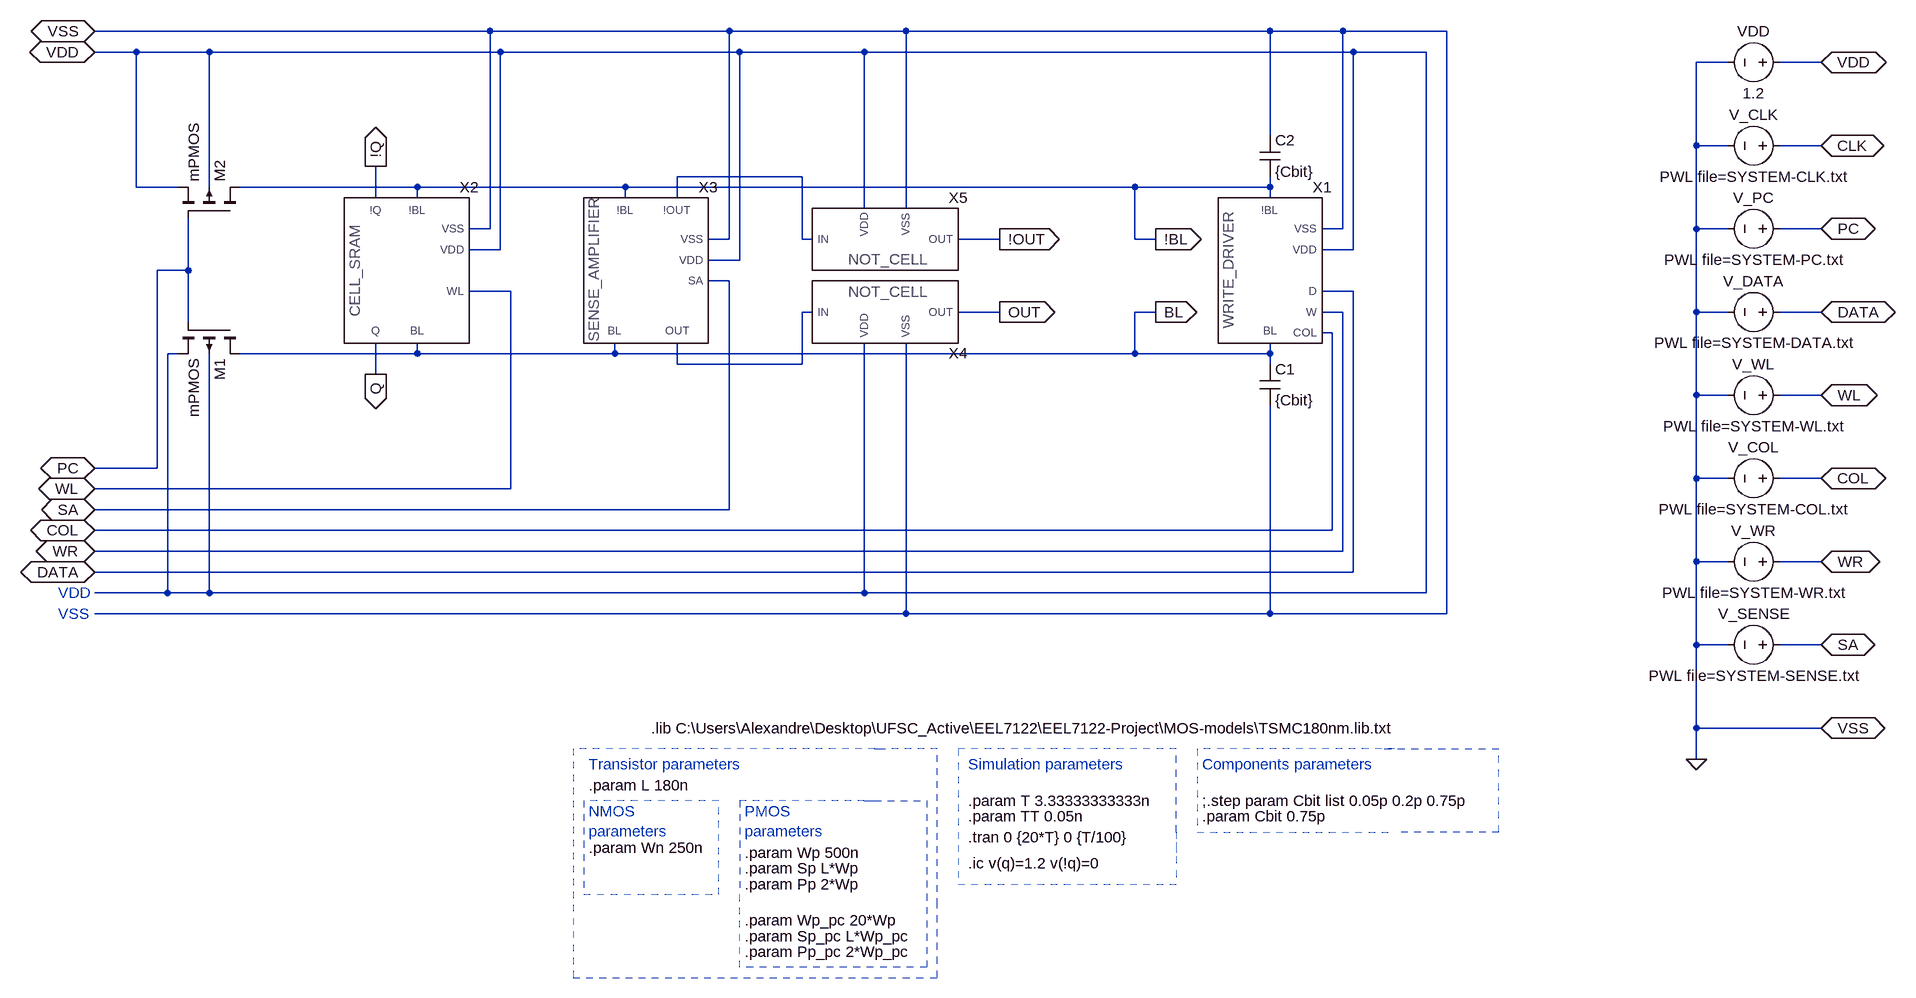
[diagram p0: schematic SYSTEM.asc]
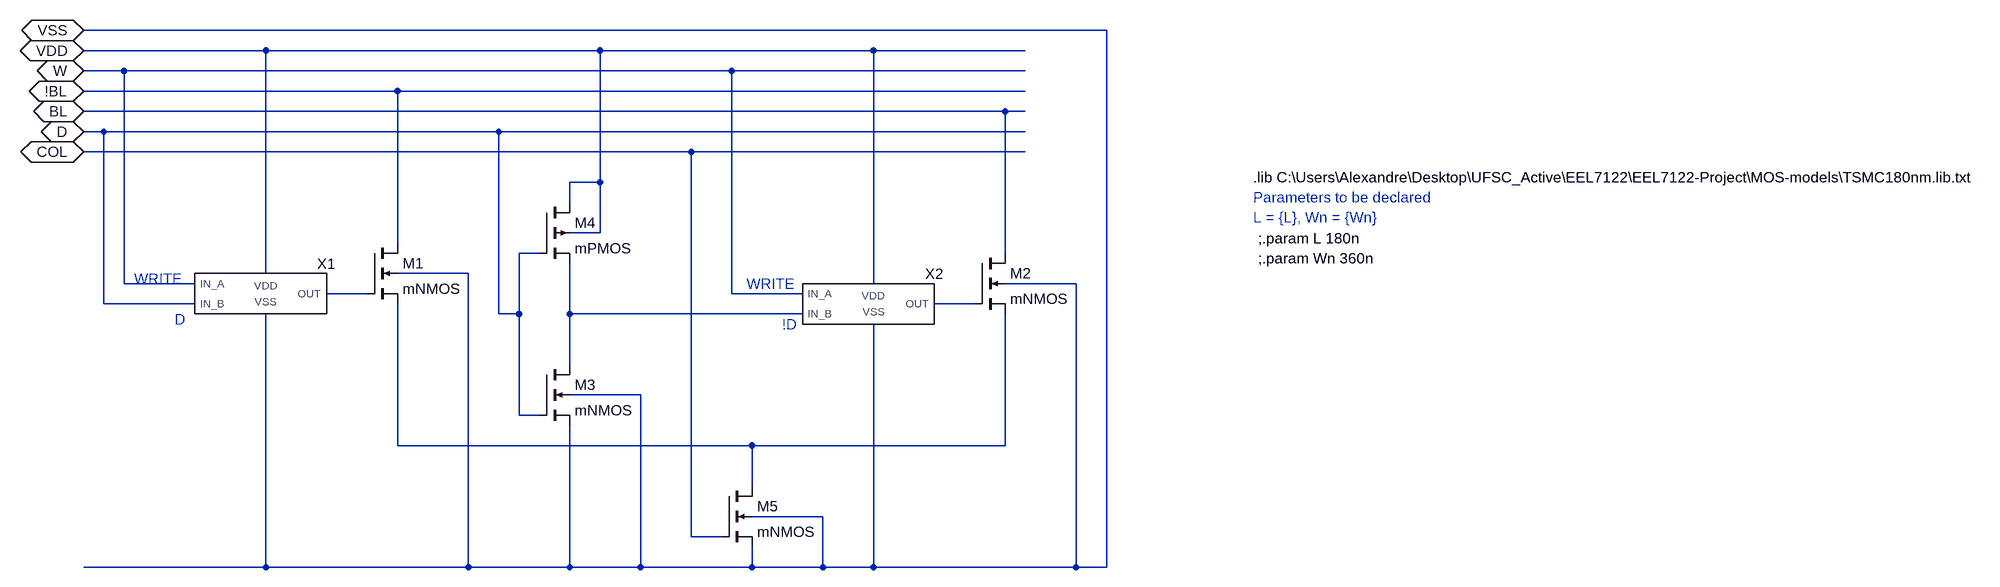
[diagram p1: sub-circuit write_driver.asc]
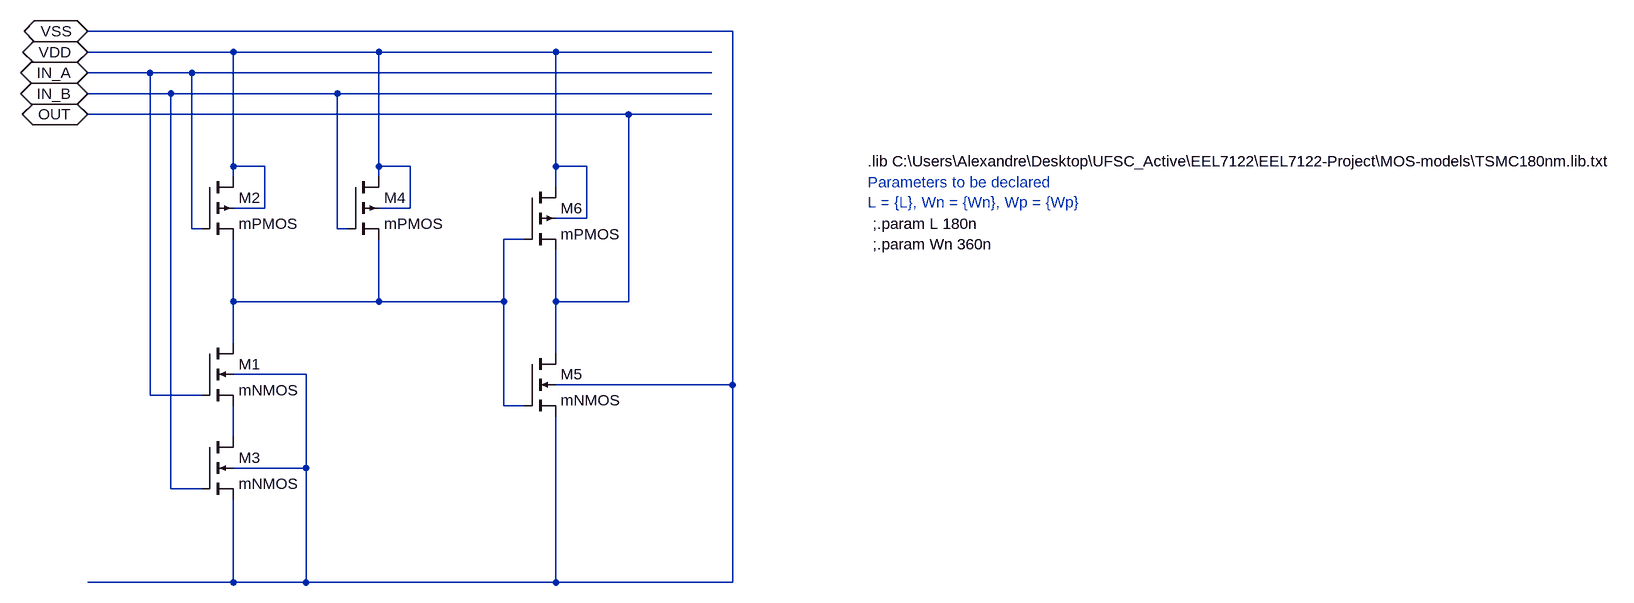
[diagram p2: sub-circuit and_sram.asc]
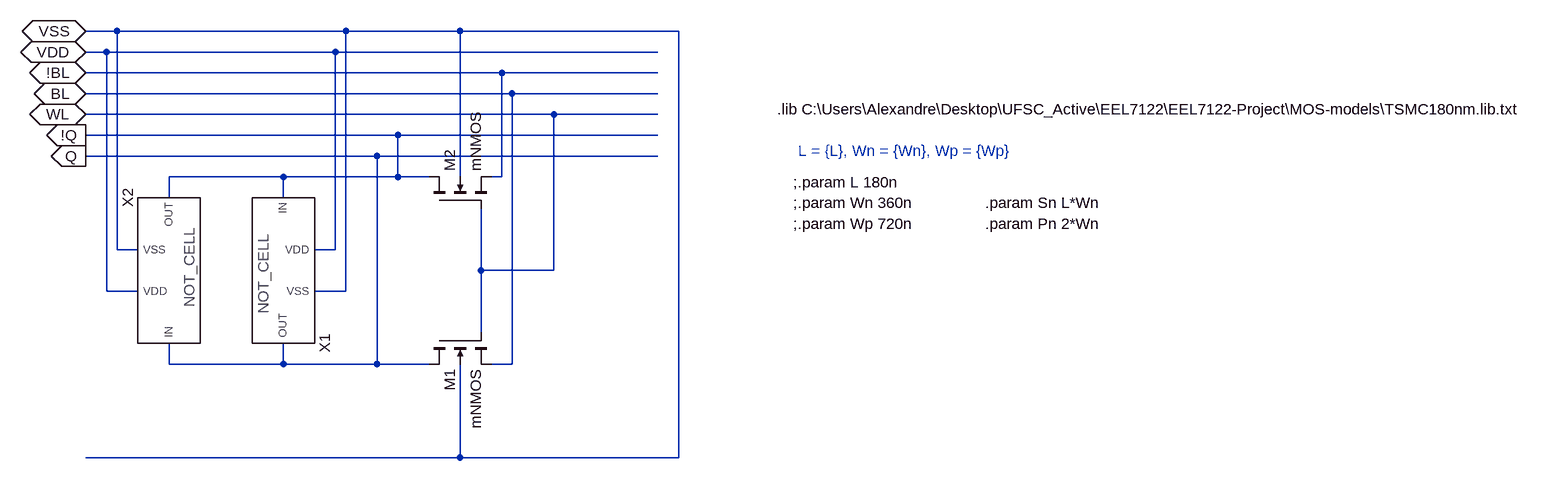
[diagram p3: sub-circuit cell_sram.asc]
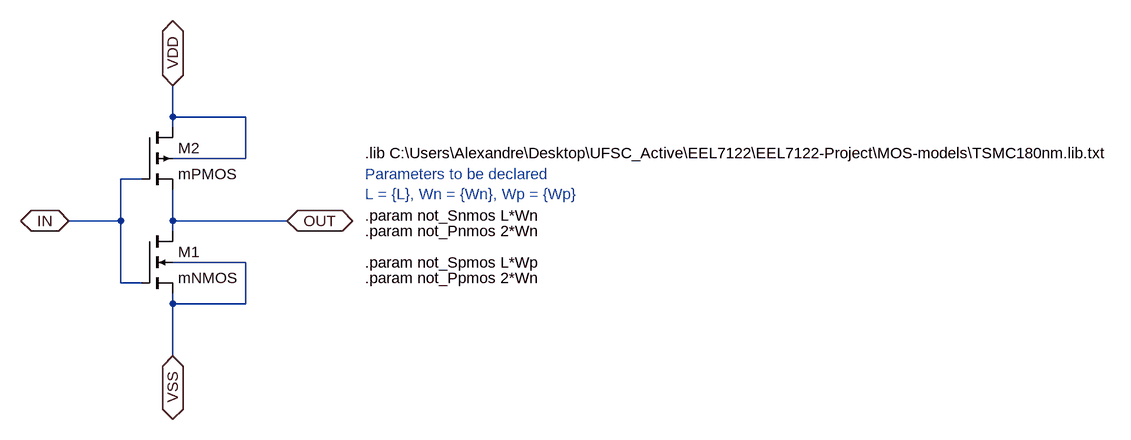
[diagram p4: sub-circuit not_cell.asc]
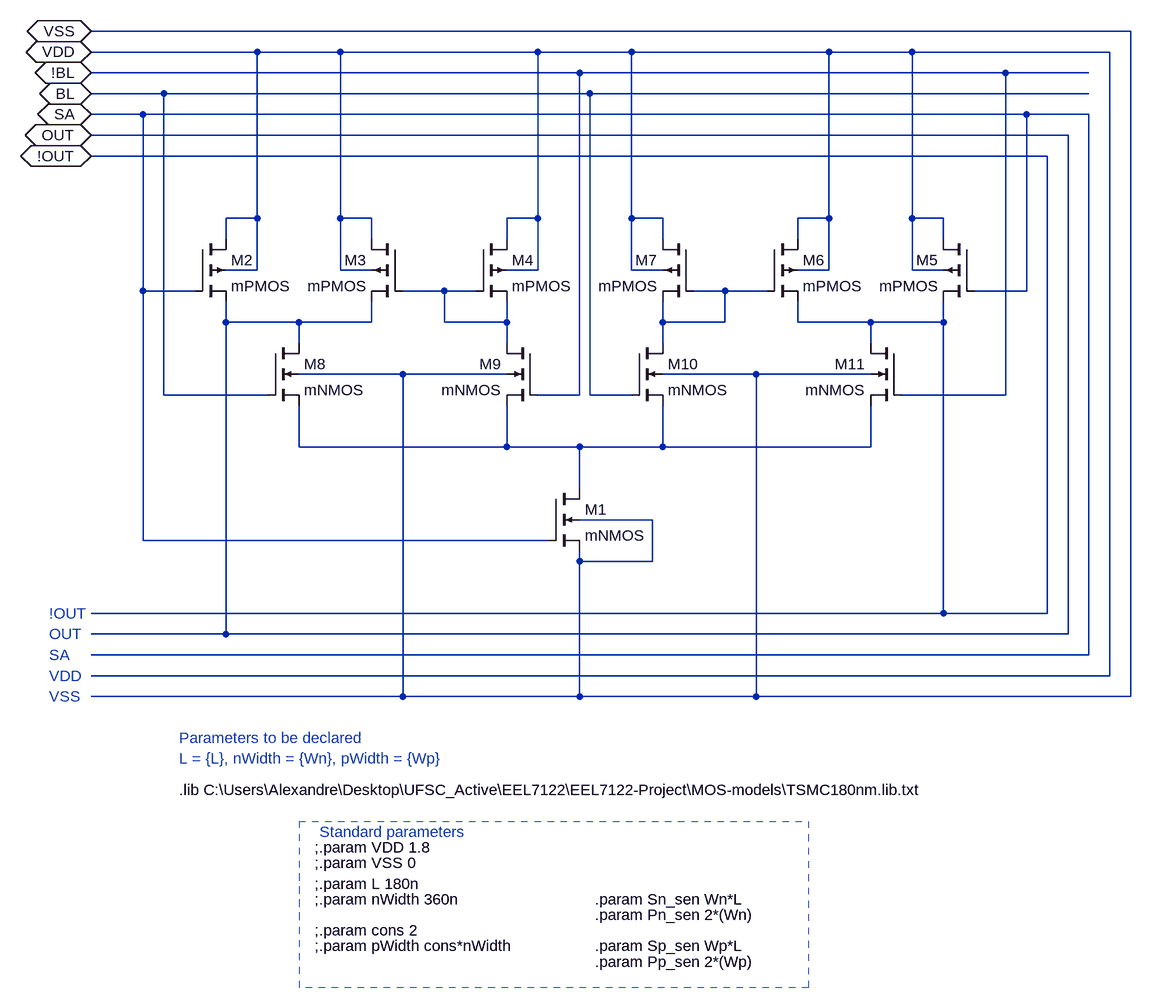
[diagram p5: sub-circuit sen_amp_2.asc]
SYSTEM.asc, the LTspice schematic file:
Version 4
SHEET 1 2612 1236
WIRE -432 -224 -1040 -224
WIRE -64 -224 -432 -224
WIRE 208 -224 -64 -224
WIRE 768 -224 208 -224
WIRE 880 -224 768 -224
WIRE 1040 -224 880 -224
WIRE -976 -192 -1040 -192
WIRE -864 -192 -976 -192
WIRE -416 -192 -864 -192
WIRE -48 -192 -416 -192
WIRE 144 -192 -48 -192
WIRE 896 -192 144 -192
WIRE 1008 -192 896 -192
WIRE 1472 -176 1424 -176
WIRE 1616 -176 1552 -176
WIRE 768 -64 768 -224
WIRE 1424 -48 1424 -176
WIRE 1472 -48 1424 -48
WIRE 1616 -48 1552 -48
WIRE 48 0 -144 0
WIRE -976 16 -976 -192
WIRE -912 16 -976 16
WIRE -864 16 -864 -192
WIRE -544 16 -816 16
WIRE -224 16 -544 16
WIRE 560 16 -224 16
WIRE 768 16 768 0
WIRE 768 16 560 16
WIRE -608 32 -608 -16
WIRE -544 32 -544 16
WIRE -224 32 -224 16
WIRE -144 32 -144 0
WIRE 768 32 768 16
WIRE 144 48 144 -192
WIRE 208 48 208 -224
WIRE -432 80 -432 -224
WIRE -432 80 -464 80
WIRE 880 80 880 -224
WIRE 880 80 848 80
WIRE 1424 80 1424 -48
WIRE 1472 80 1424 80
WIRE 1616 80 1552 80
WIRE -64 96 -64 -224
WIRE -64 96 -96 96
WIRE 48 96 48 0
WIRE 64 96 48 96
WIRE 352 96 288 96
WIRE 560 96 560 16
WIRE 592 96 560 96
WIRE -416 112 -416 -192
WIRE -416 112 -464 112
WIRE 896 112 896 -192
WIRE 896 112 848 112
WIRE -48 128 -48 -192
WIRE -48 128 -96 128
WIRE -896 144 -896 64
WIRE -896 144 -944 144
WIRE -64 160 -96 160
WIRE -400 176 -464 176
WIRE 896 176 848 176
WIRE 64 208 48 208
WIRE 352 208 288 208
WIRE 592 208 560 208
WIRE 880 208 848 208
WIRE 1424 208 1424 80
WIRE 1472 208 1424 208
WIRE 1616 208 1552 208
WIRE -896 224 -896 144
WIRE 864 240 848 240
WIRE -912 272 -928 272
WIRE -544 272 -544 256
WIRE -544 272 -816 272
WIRE -240 272 -240 256
WIRE -240 272 -544 272
WIRE 560 272 560 208
WIRE 560 272 -240 272
WIRE 768 272 768 256
WIRE 768 272 560 272
WIRE -144 288 -144 256
WIRE 48 288 48 208
WIRE 48 288 -144 288
WIRE 768 288 768 272
WIRE -608 304 -608 256
WIRE 1424 336 1424 208
WIRE 1472 336 1424 336
WIRE 1616 336 1552 336
WIRE -944 448 -944 144
WIRE -944 448 -1040 448
WIRE 1424 464 1424 336
WIRE 1472 464 1424 464
WIRE 1616 464 1552 464
WIRE -400 480 -400 176
WIRE -400 480 -1040 480
WIRE -64 512 -64 160
WIRE -64 512 -1040 512
WIRE 864 544 864 240
WIRE 864 544 -1040 544
WIRE 880 576 880 208
WIRE 880 576 -1040 576
WIRE 1424 592 1424 464
WIRE 1472 592 1424 592
WIRE 1616 592 1552 592
WIRE 896 608 896 176
WIRE 896 608 -1040 608
WIRE -928 640 -928 272
WIRE -928 640 -1040 640
WIRE -864 640 -864 272
WIRE -864 640 -928 640
WIRE 144 640 144 256
WIRE 144 640 -864 640
WIRE 1008 640 1008 -192
WIRE 1008 640 144 640
WIRE 208 672 208 256
WIRE 208 672 -1040 672
WIRE 768 672 768 352
WIRE 768 672 208 672
WIRE 1040 672 1040 -224
WIRE 1040 672 768 672
WIRE 1424 720 1424 592
WIRE 1472 720 1424 720
WIRE 1616 720 1552 720
WIRE 1424 848 1424 720
WIRE 1616 848 1424 848
WIRE 1424 896 1424 848
FLAG -1040 -192 VDD
IOPIN -1040 -192 BiDir
FLAG -1040 -224 VSS
IOPIN -1040 -224 BiDir
FLAG 1424 896 0
FLAG 1616 -176 VDD
IOPIN 1616 -176 BiDir
FLAG 1616 -48 CLK
IOPIN 1616 -48 BiDir
FLAG 1616 80 PC
IOPIN 1616 80 BiDir
FLAG 1616 208 DATA
IOPIN 1616 208 BiDir
FLAG 1616 336 WL
IOPIN 1616 336 BiDir
FLAG 1616 464 COL
IOPIN 1616 464 BiDir
FLAG 1616 848 VSS
IOPIN 1616 848 BiDir
FLAG -1040 448 PC
IOPIN -1040 448 BiDir
FLAG -1040 608 DATA
IOPIN -1040 608 BiDir
FLAG -1040 480 WL
IOPIN -1040 480 BiDir
FLAG -1040 544 COL
IOPIN -1040 544 BiDir
FLAG -1040 576 WR
IOPIN -1040 576 BiDir
FLAG 592 208 BL
IOPIN 592 208 Out
FLAG 592 96 !BL
IOPIN 592 96 Out
FLAG -608 -16 !Q
IOPIN -608 -16 Out
FLAG -608 304 Q
IOPIN -608 304 Out
FLAG 1616 592 WR
IOPIN 1616 592 BiDir
FLAG -1040 512 SA
IOPIN -1040 512 BiDir
FLAG 1616 720 SA
IOPIN 1616 720 BiDir
FLAG 352 96 !OUT
IOPIN 352 96 Out
FLAG 352 208 OUT
IOPIN 352 208 Out
SYMBOL WRITE_DRIVER 768 144 R0
SYMATTR InstName X1
SYMATTR SpiceLine L = {L}, Wn = {Wn}, Wp = {Wp}
SYMBOL CELL_SRAM -560 144 R0
SYMATTR InstName X2
SYMATTR SpiceLine L = {L}, Wn = {Wn}, Wp = {Wp}
SYMBOL pmos4 -816 224 R90
SYMATTR InstName M1
SYMATTR Value mPMOS
SYMATTR Value2 l={L} w={Wp_pc} ad={Sp_pc} as={Sp_pc} pd={Pp_pc} ps={Pp_pc} m=1
SYMBOL pmos4 -816 64 M270
SYMATTR InstName M2
SYMATTR Value mPMOS
SYMATTR Value2 l={L} w={Wp_pc} ad={Sp_pc} as={Sp_pc} pd={Pp_pc} ps={Pp_pc} m=1
SYMBOL voltage 1568 -176 R90
WINDOW 0 -32 56 VBottom 2
WINDOW 3 32 56 VTop 2
WINDOW 123 0 0 Left 0
WINDOW 39 0 0 Left 0
SYMATTR InstName VDD
SYMATTR Value 1.2
SYMBOL voltage 1568 -48 R90
WINDOW 0 -32 56 VBottom 2
WINDOW 3 32 56 VTop 2
WINDOW 123 0 0 Left 0
WINDOW 39 0 0 Left 0
SYMATTR InstName V_CLK
SYMATTR Value PWL file=SYSTEM-CLK.txt
SYMBOL voltage 1568 80 R90
WINDOW 0 -32 56 VBottom 2
WINDOW 3 32 56 VTop 2
WINDOW 123 0 0 Left 0
WINDOW 39 0 0 Left 0
SYMATTR InstName V_PC
SYMATTR Value PWL file=SYSTEM-PC.txt
SYMBOL voltage 1568 208 R90
WINDOW 0 -32 56 VBottom 2
WINDOW 3 32 56 VTop 2
WINDOW 123 0 0 Left 0
WINDOW 39 0 0 Left 0
SYMATTR InstName V_DATA
SYMATTR Value PWL file=SYSTEM-DATA.txt
SYMBOL voltage 1568 336 R90
WINDOW 0 -32 56 VBottom 2
WINDOW 3 32 56 VTop 2
WINDOW 123 0 0 Left 0
WINDOW 39 0 0 Left 0
SYMATTR InstName V_WL
SYMATTR Value PWL file=SYSTEM-WL.txt
SYMBOL voltage 1568 464 R90
WINDOW 0 -32 56 VBottom 2
WINDOW 3 32 56 VTop 2
WINDOW 123 0 0 Left 0
WINDOW 39 0 0 Left 0
SYMATTR InstName V_COL
SYMATTR Value PWL file=SYSTEM-COL.txt
SYMBOL cap 752 288 R0
SYMATTR InstName C1
SYMATTR Value {Cbit}
SYMBOL cap 752 -64 R0
SYMATTR InstName C2
SYMATTR Value {Cbit}
SYMBOL voltage 1568 592 R90
WINDOW 0 -32 56 VBottom 2
WINDOW 3 32 56 VTop 2
WINDOW 123 0 0 Left 0
WINDOW 39 0 0 Left 0
SYMATTR InstName V_WR
SYMATTR Value PWL file=SYSTEM-WR.txt
SYMBOL voltage 1568 720 R90
WINDOW 0 -32 56 VBottom 2
WINDOW 3 32 56 VTop 2
WINDOW 123 0 0 Left 0
WINDOW 39 0 0 Left 0
SYMATTR InstName V_SENSE
SYMATTR Value PWL file=SYSTEM-SENSE.txt
SYMBOL SEN_AMP_2 -192 144 R0
SYMATTR InstName X3
SYMATTR SpiceLine L = {L}, nWidth = {Wn}, pWidth = {Wp}
SYMBOL NOT_CELL 176 208 M180
SYMATTR InstName X4
SYMATTR SpiceLine L = {L}, Wn = {Wn}, Wp = {Wp}
SYMBOL NOT_CELL 176 96 R0
SYMATTR InstName X5
SYMATTR SpiceLine L = {L}, Wn = {Wn}, Wp = {Wp}
TEXT -280 936 Left 2 !.param L 180n
TEXT -280 1032 Left 2 !.param Wn 250n
TEXT -40 1040 Left 2 !.param Wp 500n
TEXT -184 848 Left 2 !.lib C:\\Users\\Alexandre\\Desktop\\UFSC_Active\\EEL7122\\EEL7122-Project\\MOS-models\\TSMC180nm.lib.txt
TEXT -40 1064 Left 2 !.param Sp L*Wp
TEXT -40 1088 Left 2 !.param Pp 2*Wp
TEXT -280 976 Left 2 ;NMOS\nparameters
TEXT -40 976 Left 2 ;PMOS\nparameters
TEXT -1096 640 Left 2 ;VDD
TEXT -1096 672 Left 2 ;VSS
TEXT 304 960 Left 2 !.param T 3.33333333333n
TEXT 304 1016 Left 2 !.tran 0 {20*T} 0 {T/100}
TEXT 664 960 Left 2 !;.step param Cbit list 0.05p 0.2p 0.75p
TEXT -280 904 Left 2 ;Transistor parameters
TEXT 304 904 Left 2 ;Simulation parameters
TEXT 664 904 Left 2 ;Components parameters
TEXT -40 1144 Left 2 !.param Wp_pc 20*Wp
TEXT -40 1168 Left 2 !.param Sp_pc L*Wp_pc
TEXT -40 1192 Left 2 !.param Pp_pc 2*Wp_pc
TEXT 664 984 Left 2 !.param Cbit 0.75p
TEXT 304 984 Left 2 !.param TT 0.05n
TEXT 304 1056 Left 2 !.ic v(q)=1.2 v(!q)=0
LINE Normal 160 880 -304 880 2
LINE Normal 256 1120 256 880 2
LINE Normal -304 1232 160 1232 2
LINE Normal -304 880 -304 1120 2
LINE Normal -80 960 -288 960 2
LINE Normal -80 1104 -80 960 2
LINE Normal -288 1104 -80 1104 2
LINE Normal -288 960 -288 1104 2
LINE Normal 144 960 -48 960 2
LINE Normal -48 960 -48 1104 2
LINE Normal 160 880 176 880 2
LINE Normal 144 960 160 960 2
LINE Normal 624 880 288 880 2
LINE Normal 624 1008 624 880 2
LINE Normal 288 1088 624 1088 2
LINE Normal 288 880 288 1008 2
LINE Normal 960 880 656 880 2
LINE Normal 1120 1008 1120 880 2
LINE Normal 656 1008 960 1008 2
LINE Normal 656 880 656 1008 2
LINE Normal 624 1008 624 1040 2
LINE Normal 288 1008 288 1088 2
LINE Normal 624 1024 624 1088 2
LINE Normal 944 880 1120 880 2
LINE Normal 1120 1008 960 1008 2
LINE Normal -304 1120 -304 1232 2
LINE Normal -48 1216 -48 1104 2
LINE Normal -48 1216 -48 1216 2
LINE Normal 240 1216 -48 1216 2
LINE Normal 240 960 240 1216 2
LINE Normal 160 960 240 960 2
LINE Normal 256 880 176 880 2
LINE Normal 256 1232 256 1104 2
LINE Normal 256 1232 256 1232 2
LINE Normal 160 1232 256 1232 2

write_driver.asc, the sub-circuit schematic file:
Version 4
SHEET 1 2788 680
WIRE 1296 -368 -320 -368
WIRE -32 -336 -320 -336
WIRE 496 -336 -32 -336
WIRE 928 -336 496 -336
WIRE 1168 -336 928 -336
WIRE -256 -304 -320 -304
WIRE 704 -304 -256 -304
WIRE 1168 -304 704 -304
WIRE 176 -272 -320 -272
WIRE 1168 -272 176 -272
WIRE 1136 -240 -320 -240
WIRE 1168 -240 1136 -240
WIRE -288 -208 -320 -208
WIRE 336 -208 -288 -208
WIRE 1168 -208 336 -208
WIRE 640 -176 -320 -176
WIRE 1168 -176 640 -176
WIRE 496 -128 496 -336
WIRE 496 -128 448 -128
WIRE 448 -96 448 -128
WIRE 496 -48 496 -128
WIRE 496 -48 448 -48
WIRE 176 -32 176 -272
WIRE 400 -16 368 -16
WIRE 1136 -16 1136 -240
WIRE -32 16 -32 -336
WIRE 288 16 176 16
WIRE -256 32 -256 -304
WIRE -144 32 -256 32
WIRE 928 32 928 -336
WIRE 1248 32 1136 32
WIRE 128 48 64 48
WIRE 704 48 704 -304
WIRE 816 48 704 48
WIRE -288 64 -288 -208
WIRE -144 64 -288 64
WIRE 1088 64 1024 64
WIRE 336 80 336 -208
WIRE 368 80 368 -16
WIRE 368 80 336 80
WIRE 448 80 448 0
WIRE 816 80 448 80
WIRE 448 160 448 80
WIRE 560 208 448 208
WIRE 368 240 368 80
WIRE 400 240 368 240
WIRE 176 288 176 64
WIRE 736 288 176 288
WIRE 1136 288 1136 80
WIRE 1136 288 736 288
WIRE 736 352 736 288
WIRE 848 400 736 400
WIRE 640 432 640 -176
WIRE 688 432 640 432
WIRE -32 480 -32 80
WIRE -32 480 -320 480
WIRE 288 480 288 16
WIRE 288 480 -32 480
WIRE 448 480 448 256
WIRE 448 480 288 480
WIRE 560 480 560 208
WIRE 560 480 448 480
WIRE 736 480 736 448
WIRE 736 480 560 480
WIRE 848 480 848 400
WIRE 848 480 736 480
WIRE 928 480 928 96
WIRE 928 480 848 480
WIRE 1248 480 1248 32
WIRE 1248 480 928 480
WIRE 1296 480 1296 -368
WIRE 1296 480 1248 480
FLAG -320 -368 VSS
IOPIN -320 -368 BiDir
FLAG -320 -336 VDD
IOPIN -320 -336 BiDir
FLAG -320 -304 W
IOPIN -320 -304 BiDir
FLAG -320 -272 !BL
IOPIN -320 -272 BiDir
FLAG -320 -240 BL
IOPIN -320 -240 BiDir
FLAG -320 -208 D
IOPIN -320 -208 BiDir
FLAG -320 -176 COL
IOPIN -320 -176 BiDir
SYMBOL AND_SRAM -32 48 R0
SYMATTR InstName X1
SYMATTR SpiceLine L = {L}, Wn = {Wn}, Wp = {Wp}
SYMBOL AND_SRAM 928 64 R0
SYMATTR InstName X2
SYMATTR SpiceLine L = {L}, Wn = {Wn}, Wp = {Wp}
SYMBOL nmos4 128 -32 R0
SYMATTR InstName M1
SYMATTR Value mNMOS
SYMATTR Value2 l={L} w={50*Wn} ad={L*50*Wn} as={L*50*Wn} pd={2*50*Wn} ps={2*50*Wn} m=1
SYMBOL nmos4 1088 -16 R0
SYMATTR InstName M2
SYMATTR Value mNMOS
SYMATTR Value2 l={L} w={50*Wn} ad={L*50*Wn} as={L*50*Wn} pd={2*50*Wn} ps={2*50*Wn} m=1
SYMBOL nmos4 400 160 R0
SYMATTR InstName M3
SYMATTR Value mNMOS
SYMATTR Value2 l={L} w={Wn} ad={L*Wn} as={L*Wn} pd={2*Wn} ps={2*Wn} m=1
SYMBOL pmos4 400 -96 R0
SYMATTR InstName M4
SYMATTR Value mPMOS
SYMATTR Value2 l={L} w={Wp} ad={2*Wn*L} as={2*Wn*L} pd={2*2*Wn} ps={2*2*Wn} m=1
SYMBOL nmos4 688 352 R0
SYMATTR InstName M5
SYMATTR Value mNMOS
SYMATTR Value2 l={L} w={50*Wn} ad={L*50*Wn} as={L*50*Wn} pd={2*50*Wn} ps={2*50*Wn} m=1
TEXT 728 32 Left 2 ;WRITE
TEXT -240 24 Left 2 ;WRITE
TEXT 784 96 Left 2 ;!D
TEXT -176 88 Left 2 ;D
TEXT 1528 -136 Left 2 !.lib C:\\Users\\Alexandre\\Desktop\\UFSC_Active\\EEL7122\\EEL7122-Project\\MOS-models\\TSMC180nm.lib.txt
TEXT 1536 -40 Left 2 !;.param L 180n
TEXT 1536 -8 Left 2 !;.param Wn 360n
TEXT 1528 -104 Left 2 ;Parameters to be declared\nL = {L}, Wn = {Wn}

and_sram.asc, the sub-circuit schematic file:
Version 4
SHEET 1 2396 680
WIRE 928 -176 -64 -176
WIRE 160 -144 -64 -144
WIRE 384 -144 160 -144
WIRE 656 -144 384 -144
WIRE 896 -144 656 -144
WIRE 32 -112 -64 -112
WIRE 96 -112 32 -112
WIRE 896 -112 96 -112
WIRE 64 -80 -64 -80
WIRE 320 -80 64 -80
WIRE 896 -80 320 -80
WIRE 768 -48 -64 -48
WIRE 896 -48 768 -48
WIRE 160 32 160 -144
WIRE 208 32 160 32
WIRE 384 32 384 -144
WIRE 432 32 384 32
WIRE 656 32 656 -144
WIRE 704 32 656 32
WIRE 160 48 160 32
WIRE 384 48 384 32
WIRE 656 64 656 32
WIRE 208 96 208 32
WIRE 208 96 160 96
WIRE 432 96 432 32
WIRE 432 96 384 96
WIRE 704 112 704 32
WIRE 704 112 656 112
WIRE 96 128 96 -112
WIRE 112 128 96 128
WIRE 320 128 320 -80
WIRE 336 128 320 128
WIRE 608 144 576 144
WIRE 160 240 160 144
WIRE 384 240 384 144
WIRE 384 240 160 240
WIRE 576 240 576 144
WIRE 576 240 384 240
WIRE 656 240 656 160
WIRE 768 240 768 -48
WIRE 768 240 656 240
WIRE 160 304 160 240
WIRE 656 320 656 240
WIRE 272 352 160 352
WIRE 928 368 928 -176
WIRE 928 368 656 368
WIRE 32 384 32 -112
WIRE 112 384 32 384
WIRE 576 400 576 240
WIRE 608 400 576 400
WIRE 160 448 160 400
WIRE 272 496 272 352
WIRE 272 496 160 496
WIRE 64 528 64 -80
WIRE 112 528 64 528
WIRE 160 672 160 544
WIRE 160 672 -64 672
WIRE 272 672 272 496
WIRE 272 672 160 672
WIRE 656 672 656 416
WIRE 656 672 272 672
WIRE 928 672 928 368
WIRE 928 672 656 672
FLAG -64 -48 OUT
IOPIN -64 -48 BiDir
FLAG -64 -144 VDD
IOPIN -64 -144 BiDir
FLAG -64 -176 VSS
IOPIN -64 -176 BiDir
FLAG -64 -112 IN_A
IOPIN -64 -112 BiDir
FLAG -64 -80 IN_B
IOPIN -64 -80 BiDir
SYMBOL nmos4 112 304 R0
SYMATTR InstName M1
SYMATTR Value mNMOS
SYMATTR Value2 l={L} w={2*Wn} ad={2*L*Wn} as={2*L*Wn} pd={2*2*Wn} ps={2*2*Wn} m=1
SYMBOL pmos4 112 48 R0
SYMATTR InstName M2
SYMATTR Value mPMOS
SYMATTR Value2 l={L} w={Wp} ad={2*Wn*L} as={2*Wn*L} pd={2*2*Wn} ps={2*2*Wn} m=1
SYMBOL nmos4 112 448 R0
SYMATTR InstName M3
SYMATTR Value mNMOS
SYMATTR Value2 l={L} w={2*Wn} ad={2*L*Wn} as={2*L*Wn} pd={2*2*Wn} ps={2*2*Wn} m=1
SYMBOL pmos4 336 48 R0
SYMATTR InstName M4
SYMATTR Value mPMOS
SYMATTR Value2 l={L} w={Wp} ad={2*Wn*L} as={2*Wn*L} pd={2*2*Wn} ps={2*2*Wn} m=1
SYMBOL nmos4 608 320 R0
SYMATTR InstName M5
SYMATTR Value mNMOS
SYMATTR Value2 l={L} w={Wn} ad={L*Wn} as={L*Wn} pd={2*Wn} ps={2*Wn} m=1
SYMBOL pmos4 608 64 R0
SYMATTR InstName M6
SYMATTR Value mPMOS
SYMATTR Value2 l={L} w={Wp} ad={2*Wn*L} as={2*Wn*L} pd={2*2*Wn} ps={2*2*Wn} m=1
TEXT 1136 24 Left 2 !.lib C:\\Users\\Alexandre\\Desktop\\UFSC_Active\\EEL7122\\EEL7122-Project\\MOS-models\\TSMC180nm.lib.txt
TEXT 1144 120 Left 2 !;.param L 180n
TEXT 1144 152 Left 2 !;.param Wn 360n
TEXT 1136 56 Left 2 ;Parameters to be declared\nL = {L}, Wn = {Wn}, Wp = {Wp}

cell_sram.asc, the sub-circuit schematic file:
Version 4
SHEET 1 2260 680
WIRE -16 -160 -64 -160
WIRE 336 -160 -16 -160
WIRE 512 -160 336 -160
WIRE 848 -160 512 -160
WIRE -32 -128 -64 -128
WIRE 320 -128 -32 -128
WIRE 816 -128 320 -128
WIRE 576 -96 -64 -96
WIRE 816 -96 576 -96
WIRE 592 -64 -64 -64
WIRE 816 -64 592 -64
WIRE 656 -32 -64 -32
WIRE 816 -32 656 -32
WIRE 416 0 -64 0
WIRE 816 0 416 0
WIRE 384 32 -64 32
WIRE 816 32 384 32
WIRE 240 64 64 64
WIRE 416 64 416 0
WIRE 416 64 240 64
WIRE 464 64 416 64
WIRE 512 64 512 -160
WIRE 576 64 576 -96
WIRE 576 64 560 64
WIRE 64 96 64 64
WIRE 240 96 240 64
WIRE -16 176 -16 -160
WIRE 16 176 -16 176
WIRE 320 176 320 -128
WIRE 320 176 288 176
WIRE 544 208 544 112
WIRE 656 208 656 -32
WIRE 656 208 544 208
WIRE -32 240 -32 -128
WIRE 16 240 -32 240
WIRE 336 240 336 -160
WIRE 336 240 288 240
WIRE 544 304 544 208
WIRE 64 352 64 320
WIRE 240 352 240 320
WIRE 240 352 64 352
WIRE 384 352 384 32
WIRE 384 352 240 352
WIRE 464 352 384 352
WIRE 592 352 592 -64
WIRE 592 352 560 352
WIRE 512 496 512 352
WIRE 512 496 -64 496
WIRE 848 496 848 -160
WIRE 848 496 512 496
FLAG -64 -128 VDD
IOPIN -64 -128 BiDir
FLAG -64 -160 VSS
IOPIN -64 -160 BiDir
FLAG -64 -96 !BL
IOPIN -64 -96 BiDir
FLAG -64 -64 BL
IOPIN -64 -64 BiDir
FLAG -64 -32 WL
IOPIN -64 -32 BiDir
FLAG -64 0 !Q
IOPIN -64 0 Out
FLAG -64 32 Q
IOPIN -64 32 Out
SYMBOL NOT_CELL 240 208 R90
SYMATTR InstName X1
SYMATTR SpiceLine L = {L}, Wn = {Wn}, Wp = {Wp}
SYMBOL NOT_CELL 64 208 R270
SYMATTR InstName X2
SYMATTR SpiceLine L = {L}, Wn = {Wn}, Wp = {Wp}
SYMBOL nmos4 464 304 M90
SYMATTR InstName M1
SYMATTR Value2 l={L} w={Wn} ad={Sn} as={Sn} pd={Pn} ps={Pn} m=1
SYMATTR Value mNMOS
SYMBOL nmos4 464 112 R270
SYMATTR InstName M2
SYMATTR Value2 l={L} w={Wn} ad={Sn} as={Sn} pd={Pn} ps={Pn} m=1
SYMATTR Value mNMOS
TEXT 1000 -40 Left 2 !.lib C:\\Users\\Alexandre\\Desktop\\UFSC_Active\\EEL7122\\EEL7122-Project\\MOS-models\\TSMC180nm.lib.txt
TEXT 1032 24 Left 2 ;L = {L}, Wn = {Wn}, Wp = {Wp}
TEXT 1024 72 Left 2 !;.param L 180n
TEXT 1024 104 Left 2 !;.param Wn 360n
TEXT 1024 136 Left 2 !;.param Wp 720n
TEXT 1320 104 Left 2 !.param Sn L*Wn
TEXT 1320 136 Left 2 !.param Pn 2*Wn

not_cell.asc, the sub-circuit schematic file:
Version 4
SHEET 1 1132 680
WIRE -592 -32 -592 -80
WIRE -480 -32 -592 -32
WIRE -592 -16 -592 -32
WIRE -480 32 -480 -32
WIRE -480 32 -592 32
WIRE -640 64 -672 64
WIRE -672 128 -672 64
WIRE -672 128 -752 128
WIRE -592 128 -592 80
WIRE -416 128 -592 128
WIRE -592 144 -592 128
WIRE -480 192 -592 192
WIRE -672 224 -672 128
WIRE -640 224 -672 224
WIRE -592 256 -592 240
WIRE -480 256 -480 192
WIRE -480 256 -592 256
WIRE -592 336 -592 256
FLAG -752 128 IN
IOPIN -752 128 BiDir
FLAG -416 128 OUT
IOPIN -416 128 BiDir
FLAG -592 336 VSS
IOPIN -592 336 BiDir
FLAG -592 -80 VDD
IOPIN -592 -80 BiDir
SYMBOL nmos4 -640 144 R0
SYMATTR InstName M1
SYMATTR Value mNMOS
SYMATTR Value2 l={L} w={Wn} ad={not_Snmos} as={not_Snmos} pd={not_Pnmos} ps={not_Pnmos} m=1
SYMBOL pmos4 -640 -16 R0
SYMATTR InstName M2
SYMATTR Value mPMOS
SYMATTR Value2 l={L} w={WP} ad={not_Spmos} as={not_Spmos} pd={not_Ppmos} ps={not_Ppmos} m=1
TEXT -296 24 Left 2 !.lib C:\\Users\\Alexandre\\Desktop\\UFSC_Active\\EEL7122\\EEL7122-Project\\MOS-models\\TSMC180nm.lib.txt
TEXT -296 192 Left 2 !.param not_Spmos L*Wp
TEXT -296 216 Left 2 !.param not_Ppmos 2*Wn
TEXT -296 120 Left 2 !.param not_Snmos L*Wn
TEXT -296 144 Left 2 !.param not_Pnmos 2*Wn
TEXT -296 56 Left 2 ;Parameters to be declared\nL = {L}, Wn = {Wn}, Wp = {Wp}

sen_amp_2.asc, the sub-circuit schematic file:
Version 4
SHEET 1 996 964
WIRE 896 -512 -704 -512
WIRE -448 -480 -704 -480
WIRE -320 -480 -448 -480
WIRE -16 -480 -320 -480
WIRE 128 -480 -16 -480
WIRE 432 -480 128 -480
WIRE 560 -480 432 -480
WIRE 864 -480 560 -480
WIRE 48 -448 -704 -448
WIRE 704 -448 48 -448
WIRE 832 -448 704 -448
WIRE -592 -416 -704 -416
WIRE 64 -416 -592 -416
WIRE 832 -416 64 -416
WIRE -624 -384 -704 -384
WIRE 736 -384 -624 -384
WIRE 832 -384 736 -384
WIRE 800 -352 -704 -352
WIRE 768 -320 -704 -320
WIRE -448 -224 -448 -480
WIRE -448 -224 -496 -224
WIRE -320 -224 -320 -480
WIRE -272 -224 -320 -224
WIRE -16 -224 -16 -480
WIRE -16 -224 -64 -224
WIRE 128 -224 128 -480
WIRE 176 -224 128 -224
WIRE 432 -224 432 -480
WIRE 432 -224 384 -224
WIRE 560 -224 560 -480
WIRE 608 -224 560 -224
WIRE -496 -192 -496 -224
WIRE -272 -192 -272 -224
WIRE -64 -192 -64 -224
WIRE 176 -192 176 -224
WIRE 384 -192 384 -224
WIRE 608 -192 608 -224
WIRE -448 -144 -448 -224
WIRE -448 -144 -496 -144
WIRE -320 -144 -320 -224
WIRE -272 -144 -320 -144
WIRE -16 -144 -16 -224
WIRE -16 -144 -64 -144
WIRE 128 -144 128 -224
WIRE 176 -144 128 -144
WIRE 432 -144 432 -224
WIRE 432 -144 384 -144
WIRE 560 -144 560 -224
WIRE 608 -144 560 -144
WIRE -624 -112 -624 -384
WIRE -544 -112 -624 -112
WIRE -160 -112 -224 -112
WIRE -112 -112 -160 -112
WIRE 272 -112 224 -112
WIRE 336 -112 272 -112
WIRE 736 -112 736 -384
WIRE 736 -112 656 -112
WIRE -496 -64 -496 -96
WIRE -384 -64 -496 -64
WIRE -272 -64 -272 -96
WIRE -272 -64 -384 -64
WIRE -160 -64 -160 -112
WIRE -64 -64 -64 -96
WIRE -64 -64 -160 -64
WIRE 176 -64 176 -96
WIRE 272 -64 272 -112
WIRE 272 -64 176 -64
WIRE 384 -64 384 -96
WIRE 496 -64 384 -64
WIRE 608 -64 608 -96
WIRE 608 -64 496 -64
WIRE -384 -32 -384 -64
WIRE -64 -32 -64 -64
WIRE 176 -32 176 -64
WIRE 496 -32 496 -64
WIRE -224 16 -384 16
WIRE -64 16 -224 16
WIRE 320 16 176 16
WIRE 496 16 320 16
WIRE -592 48 -592 -416
WIRE -432 48 -592 48
WIRE 48 48 48 -448
WIRE 48 48 -16 48
WIRE 64 48 64 -416
WIRE 128 48 64 48
WIRE 704 48 704 -448
WIRE 704 48 544 48
WIRE -384 128 -384 64
WIRE -64 128 -64 64
WIRE -64 128 -384 128
WIRE 48 128 -64 128
WIRE 176 128 176 64
WIRE 176 128 48 128
WIRE 496 128 496 64
WIRE 496 128 176 128
WIRE 48 192 48 128
WIRE 160 240 48 240
WIRE -624 272 -624 -112
WIRE 0 272 -624 272
WIRE 48 304 48 288
WIRE 160 304 160 240
WIRE 160 304 48 304
WIRE 608 384 608 -64
WIRE 608 384 -704 384
WIRE 768 384 768 -320
WIRE 768 384 608 384
WIRE -496 416 -496 -64
WIRE -496 416 -704 416
WIRE 800 416 800 -352
WIRE 800 416 -496 416
WIRE 832 448 832 -384
WIRE 832 448 -704 448
WIRE 864 480 864 -480
WIRE 864 480 -704 480
WIRE -224 512 -224 16
WIRE -224 512 -704 512
WIRE 48 512 48 304
WIRE 48 512 -224 512
WIRE 320 512 320 16
WIRE 320 512 48 512
WIRE 896 512 896 -512
WIRE 896 512 320 512
FLAG -704 -512 VSS
IOPIN -704 -512 BiDir
FLAG -704 -480 VDD
IOPIN -704 -480 BiDir
FLAG -704 -448 !BL
IOPIN -704 -448 BiDir
FLAG -704 -416 BL
IOPIN -704 -416 BiDir
FLAG -704 -384 SA
IOPIN -704 -384 BiDir
FLAG -704 -352 OUT
IOPIN -704 -352 BiDir
FLAG -704 -320 !OUT
IOPIN -704 -320 BiDir
SYMBOL nmos4 0 192 R0
SYMATTR InstName M1
SYMATTR Value mNMOS
SYMATTR Value2 l={L} w={nWidth} ad={Sn_sen} as={Sn_sen} pd={Pn_sen} ps={Pn_sen} m=1
SYMBOL pmos4 -544 -192 R0
SYMATTR InstName M2
SYMATTR Value mPMOS
SYMATTR Value2 l=180n w={pWidth} ad={Sp_sen} as={Sp_sen} pd={Pp_sen} ps={Pp_sen} m=1
SYMBOL pmos4 -224 -192 M0
SYMATTR InstName M3
SYMATTR Value mPMOS
SYMATTR Value2 l=180n w={pWidth} ad={Sp_sen} as={Sp_sen} pd={Pp_sen} ps={Pp_sen} m=1
SYMBOL pmos4 -112 -192 R0
SYMATTR InstName M4
SYMATTR Value mPMOS
SYMATTR Value2 l=180n w={pWidth} ad={Sp_sen} as={Sp_sen} pd={Pp_sen} ps={Pp_sen} m=1
SYMBOL pmos4 656 -192 M0
SYMATTR InstName M5
SYMATTR Value mPMOS
SYMATTR Value2 l=180n w={pWidth} ad={Sp_sen} as={Sp_sen} pd={Pp_sen} ps={Pp_sen} m=1
SYMBOL pmos4 336 -192 R0
SYMATTR InstName M6
SYMATTR Value mPMOS
SYMATTR Value2 l=180n w={pWidth} ad={Sp_sen} as={Sp_sen} pd={Pp_sen} ps={Pp_sen} m=1
SYMBOL pmos4 224 -192 M0
SYMATTR InstName M7
SYMATTR Value mPMOS
SYMATTR Value2 l=180n w={pWidth} ad={Sp_sen} as={Sp_sen} pd={Pp_sen} ps={Pp_sen} m=1
SYMBOL nmos4 -432 -32 R0
SYMATTR InstName M8
SYMATTR Value mNMOS
SYMATTR Value2 l={L} w={nWidth} ad={Sn_sen} as={Sn_sen} pd={Pn_sen} ps={Pn_sen} m=1
SYMBOL nmos4 -16 -32 M0
SYMATTR InstName M9
SYMATTR Value mNMOS
SYMATTR Value2 l={L} w={nWidth} ad={Sn_sen} as={Sn_sen} pd={Pn_sen} ps={Pn_sen} m=1
SYMBOL nmos4 128 -32 R0
SYMATTR InstName M10
SYMATTR Value mNMOS
SYMATTR Value2 l={L} w={nWidth} ad={Sn_sen} as={Sn_sen} pd={Pn_sen} ps={Pn_sen} m=1
SYMBOL nmos4 544 -32 M0
SYMATTR InstName M11
SYMATTR Value mNMOS
SYMATTR Value2 l={L} w={nWidth} ad={Sn_sen} as={Sn_sen} pd={Pn_sen} ps={Pn_sen} m=1
TEXT -568 656 Left 2 !.lib C:\\Users\\Alexandre\\Desktop\\UFSC_Active\\EEL7122\\EEL7122-Project\\MOS-models\\TSMC180nm.lib.txt
TEXT -352 720 Left 2 ;Standard parameters
TEXT -360 744 Left 2 !;.param VDD 1.8
TEXT -360 768 Left 2 !;.param VSS 0
TEXT -360 824 Left 2 !;.param nWidth 360n
TEXT -360 896 Left 2 !;.param pWidth cons*nWidth
TEXT 72 896 Left 2 !.param Sp_sen Wp*L
TEXT 72 920 Left 2 !.param Pp_sen 2*(Wp)
TEXT 72 824 Left 2 !.param Sn_sen Wn*L
TEXT 72 848 Left 2 !.param Pn_sen 2*(Wn)
TEXT -360 872 Left 2 !;.param cons 2
TEXT -360 800 Left 2 !;.param L 180n
TEXT -568 576 Left 2 ;Parameters to be declared\nL = {L}, nWidth = {Wn}, pWidth = {Wp}
TEXT -768 416 Left 2 ;OUT
TEXT -768 384 Left 2 ;!OUT
TEXT -768 448 Left 2 ;SA
TEXT -768 480 Left 2 ;VDD
TEXT -768 512 Left 2 ;VSS
LINE Normal -384 704 240 704 2
LINE Normal -384 704 -384 928 2
LINE Normal -384 928 -384 960 2
LINE Normal -384 784 -384 864 2
LINE Normal 400 960 -384 960 2
LINE Normal 400 704 400 960 2
LINE Normal 240 704 400 704 2

The netlist it stands for:
* SYSTEM.asc
XX1 !BL BL DATA VDD 0 WR COL write_driver params: L = {L}, Wn = {Wn}, Wp = {Wp}
XX2 !BL BL VDD 0 WL !Q Q cell_sram params: L = {L}, Wn = {Wn}, Wp = {Wp}
M1 BL PC VDD VDD mPMOS l={L} w={Wp_pc} ad={Sp_pc} as={Sp_pc} pd={Pp_pc} ps={Pp_pc} m=1
M2 !BL PC VDD VDD mPMOS l={L} w={Wp_pc} ad={Sp_pc} as={Sp_pc} pd={Pp_pc} ps={Pp_pc} m=1
VDD VDD 0 1.2
V_CLK CLK 0 PWL file=SYSTEM-CLK.txt
V_PC PC 0 PWL file=SYSTEM-PC.txt
V_DATA DATA 0 PWL file=SYSTEM-DATA.txt
V_WL WL 0 PWL file=SYSTEM-WL.txt
V_COL COL 0 PWL file=SYSTEM-COL.txt
C1 BL 0 {Cbit}
C2 0 !BL {Cbit}
V_WR WR 0 PWL file=SYSTEM-WR.txt
V_SENSE SA 0 PWL file=SYSTEM-SENSE.txt
XX3 !BL N001 BL N002 SA VDD 0 sen_amp_2 params: L = {L}, nWidth = {Wn}, pWidth = {Wp}
XX4 N002 OUT VDD 0 not_cell params: L = {L}, Wn = {Wn}, Wp = {Wp}
XX5 N001 !OUT VDD 0 not_cell params: L = {L}, Wn = {Wn}, Wp = {Wp}

* block symbol definitions
.subckt write_driver !BL BL D VDD VSS W COL
XX1 W D N001 VDD VSS and_sram params: L = {L}, Wn = {Wn}, Wp = {Wp}
XX2 W N003 N002 VDD VSS and_sram params: L = {L}, Wn = {Wn}, Wp = {Wp}
M1 !BL N001 N004 VSS mNMOS l={L} w={50*Wn} ad={L*50*Wn} as={L*50*Wn} pd={2*50*Wn} ps={2*50*Wn} m=1
M2 BL N002 N004 VSS mNMOS l={L} w={50*Wn} ad={L*50*Wn} as={L*50*Wn} pd={2*50*Wn} ps={2*50*Wn} m=1
M3 N003 D VSS VSS mNMOS l={L} w={Wn} ad={L*Wn} as={L*Wn} pd={2*Wn} ps={2*Wn} m=1
M4 VDD D N003 VDD mPMOS l={L} w={Wp} ad={2*Wn*L} as={2*Wn*L} pd={2*2*Wn} ps={2*2*Wn} m=1
M5 N004 COL VSS VSS mNMOS l={L} w={50*Wn} ad={L*50*Wn} as={L*50*Wn} pd={2*50*Wn} ps={2*50*Wn} m=1
* WRITE
* WRITE
* !D
* D
.lib C:\Users\Alexandre\Desktop\UFSC_Active\EEL7122\EEL7122-Project\MOS-models\TSMC180nm.lib.txt
;.param L 180n
;.param Wn 360n
* Parameters to be declared
* L = {L}, Wn = {Wn}
.ends write_driver

.subckt and_sram IN_A IN_B OUT VDD VSS
M1 N001 IN_A N002 VSS mNMOS l={L} w={2*Wn} ad={2*L*Wn} as={2*L*Wn} pd={2*2*Wn} ps={2*2*Wn} m=1
M2 VDD IN_A N001 VDD mPMOS l={L} w={Wp} ad={2*Wn*L} as={2*Wn*L} pd={2*2*Wn} ps={2*2*Wn} m=1
M3 N002 IN_B VSS VSS mNMOS l={L} w={2*Wn} ad={2*L*Wn} as={2*L*Wn} pd={2*2*Wn} ps={2*2*Wn} m=1
M4 VDD IN_B N001 VDD mPMOS l={L} w={Wp} ad={2*Wn*L} as={2*Wn*L} pd={2*2*Wn} ps={2*2*Wn} m=1
M5 OUT N001 VSS VSS mNMOS l={L} w={Wn} ad={L*Wn} as={L*Wn} pd={2*Wn} ps={2*Wn} m=1
M6 VDD N001 OUT VDD mPMOS l={L} w={Wp} ad={2*Wn*L} as={2*Wn*L} pd={2*2*Wn} ps={2*2*Wn} m=1
.lib C:\Users\Alexandre\Desktop\UFSC_Active\EEL7122\EEL7122-Project\MOS-models\TSMC180nm.lib.txt
;.param L 180n
;.param Wn 360n
* Parameters to be declared
* L = {L}, Wn = {Wn}, Wp = {Wp}
.ends and_sram

.subckt cell_sram !BL BL VDD VSS WL !Q Q
XX1 !Q Q VDD VSS not_cell params: L = {L}, Wn = {Wn}, Wp = {Wp}
XX2 Q !Q VDD VSS not_cell params: L = {L}, Wn = {Wn}, Wp = {Wp}
M1 Q WL BL VSS mNMOS l={L} w={Wn} ad={Sn} as={Sn} pd={Pn} ps={Pn} m=1
M2 !Q WL !BL VSS mNMOS l={L} w={Wn} ad={Sn} as={Sn} pd={Pn} ps={Pn} m=1
.lib C:\Users\Alexandre\Desktop\UFSC_Active\EEL7122\EEL7122-Project\MOS-models\TSMC180nm.lib.txt
* L = {L}, Wn = {Wn}, Wp = {Wp}
;.param L 180n
;.param Wn 360n
;.param Wp 720n
.param Sn L*Wn
.param Pn 2*Wn
.ends cell_sram

.subckt not_cell IN OUT VDD VSS
M1 OUT IN VSS VSS mNMOS l={L} w={Wn} ad={not_Snmos} as={not_Snmos} pd={not_Pnmos} ps={not_Pnmos} m=1
M2 VDD IN OUT VDD mPMOS l={L} w={WP} ad={not_Spmos} as={not_Spmos} pd={not_Ppmos} ps={not_Ppmos} m=1
.lib C:\Users\Alexandre\Desktop\UFSC_Active\EEL7122\EEL7122-Project\MOS-models\TSMC180nm.lib.txt
.param not_Spmos L*Wp
.param not_Ppmos 2*Wn
.param not_Snmos L*Wn
.param not_Pnmos 2*Wn
* Parameters to be declared
* L = {L}, Wn = {Wn}, Wp = {Wp}
.ends not_cell

.subckt sen_amp_2 !BL !OUT BL OUT SA VDD VSS
M1 N003 SA VSS VSS mNMOS l={L} w={nWidth} ad={Sn_sen} as={Sn_sen} pd={Pn_sen} ps={Pn_sen} m=1
M2 VDD SA OUT VDD mPMOS l=180n w={pWidth} ad={Sp_sen} as={Sp_sen} pd={Pp_sen} ps={Pp_sen} m=1
M3 VDD N001 OUT VDD mPMOS l=180n w={pWidth} ad={Sp_sen} as={Sp_sen} pd={Pp_sen} ps={Pp_sen} m=1
M4 VDD N001 N001 VDD mPMOS l=180n w={pWidth} ad={Sp_sen} as={Sp_sen} pd={Pp_sen} ps={Pp_sen} m=1
M5 VDD SA !OUT VDD mPMOS l=180n w={pWidth} ad={Sp_sen} as={Sp_sen} pd={Pp_sen} ps={Pp_sen} m=1
M6 VDD N002 !OUT VDD mPMOS l=180n w={pWidth} ad={Sp_sen} as={Sp_sen} pd={Pp_sen} ps={Pp_sen} m=1
M7 VDD N002 N002 VDD mPMOS l=180n w={pWidth} ad={Sp_sen} as={Sp_sen} pd={Pp_sen} ps={Pp_sen} m=1
M8 OUT BL N003 VSS mNMOS l={L} w={nWidth} ad={Sn_sen} as={Sn_sen} pd={Pn_sen} ps={Pn_sen} m=1
M9 N001 !BL N003 VSS mNMOS l={L} w={nWidth} ad={Sn_sen} as={Sn_sen} pd={Pn_sen} ps={Pn_sen} m=1
M10 N002 BL N003 VSS mNMOS l={L} w={nWidth} ad={Sn_sen} as={Sn_sen} pd={Pn_sen} ps={Pn_sen} m=1
M11 !OUT !BL N003 VSS mNMOS l={L} w={nWidth} ad={Sn_sen} as={Sn_sen} pd={Pn_sen} ps={Pn_sen} m=1
.lib C:\Users\Alexandre\Desktop\UFSC_Active\EEL7122\EEL7122-Project\MOS-models\TSMC180nm.lib.txt
* Standard parameters
;.param VDD 1.8
;.param VSS 0
;.param nWidth 360n
;.param pWidth cons*nWidth
.param Sp_sen Wp*L
.param Pp_sen 2*(Wp)
.param Sn_sen Wn*L
.param Pn_sen 2*(Wn)
;.param cons 2
;.param L 180n
* Parameters to be declared
* L = {L}, nWidth = {Wn}, pWidth = {Wp}
* OUT
* !OUT
* SA
* VDD
* VSS
.ends sen_amp_2

.model NMOS NMOS
.model PMOS PMOS
.lib standard.mos
.param L 180n
.param Wn 250n
.param Wp 500n
.lib C:\Users\Alexandre\Desktop\UFSC_Active\EEL7122\EEL7122-Project\MOS-models\TSMC180nm.lib.txt
.param Sp L*Wp
.param Pp 2*Wp
* NMOS
* parameters
* PMOS
* parameters
* VDD
* VSS
.param T 3.33333333333n
.tran 0 {20*T} 0 {T/100}
;.step param Cbit list 0.05p 0.2p 0.75p
* Transistor parameters
* Simulation parameters
* Components parameters
.param Wp_pc 20*Wp
.param Sp_pc L*Wp_pc
.param Pp_pc 2*Wp_pc
.param Cbit 0.75p
.param TT 0.05n
.ic v(q)=1.2 v(!q)=0
.backanno
.end